# Altium project CIU.PrjPcb
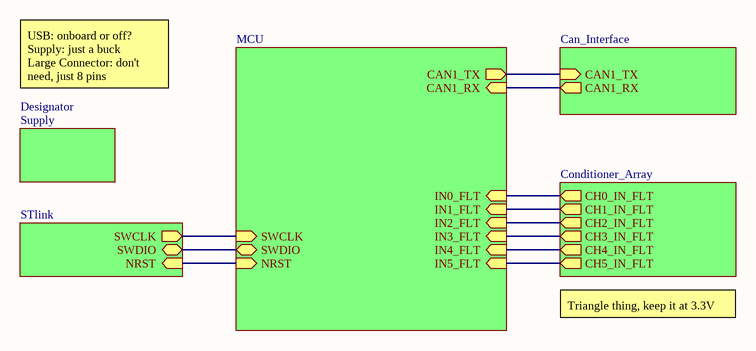
[diagram p0: Root.SchDoc]
8 sheets, 81 parts. Net scope: hierarchical (ports join the sheet entries above them; power ports are global).
Board files: OUR_CIU.PcbDoc, CIU.PcbDoc
Sheets:
  Root.SchDoc
    MCU = MCU.SchDoc
    Conditioner_Array = Conditioner_Array.SchDoc
      1 = Input_Conditioner.SchDoc
      2 = Input_Conditioner.SchDoc
      3 = Input_Conditioner.SchDoc
      4 = Input_Conditioner.SchDoc
      0 = Input_Conditioner.SchDoc
      5 = Input_Conditioner.SchDoc
      Designator = Connectors.SchDoc
      Designator = Connectors.SchDoc
      Designator = Connectors.SchDoc
      Designator = Connectors.SchDoc
      Designator = Connectors.SchDoc
      Designator = Connectors.SchDoc
    STlink = STlink.SchDoc
    Can_Interface = Can_Interface.SchDoc
    Designator = Supply.SchDoc

## Sheet Root.SchDoc
size A4; SheetNumber: 1; SheetTotal: 8

### Sub-sheets
Can_Interface = Can_Interface: CAN1_TX (in), CAN1_RX (out)
Conditioner_Array = Conditioner_Array: CH0_IN_FLT (out), CH1_IN_FLT (out), CH2_IN_FLT (out), CH3_IN_FLT (out), CH4_IN_FLT (out), CH5_IN_FLT (out)
Designator = Supply: no entries
MCU = MCU: IN1_FLT (in), IN2_FLT (in), IN3_FLT (in), IN4_FLT (in), IN5_FLT (in), IN0_FLT (in), SWCLK (in), SWDIO (bidir), CAN1_TX (out), CAN1_RX (in), NRST (in)
STlink = STlink: SWDIO (bidir), SWCLK (out), NRST (in)

### Nets
CAN1_RX: sheet MCU/CAN1_RX, sheet Can_Interface/CAN1_RX
CAN1_TX: sheet MCU/CAN1_TX, sheet Can_Interface/CAN1_TX
CH0_IN_FLT: sheet MCU/IN0_FLT, sheet Conditioner_Array/CH0_IN_FLT
CH1_IN_FLT: sheet MCU/IN1_FLT, sheet Conditioner_Array/CH1_IN_FLT
CH2_IN_FLT: sheet MCU/IN2_FLT, sheet Conditioner_Array/CH2_IN_FLT
CH3_IN_FLT: sheet MCU/IN3_FLT, sheet Conditioner_Array/CH3_IN_FLT
CH4_IN_FLT: sheet MCU/IN4_FLT, sheet Conditioner_Array/CH4_IN_FLT
CH5_IN_FLT: sheet MCU/IN5_FLT, sheet Conditioner_Array/CH5_IN_FLT
NRST: sheet MCU/NRST, sheet STlink/NRST
SWCLK: sheet MCU/SWCLK, sheet STlink/SWCLK
SWDIO: sheet MCU/SWDIO, sheet STlink/SWDIO

### Notes on the sheet
- USB: onboard or off?
  Supply: just a buck
  Large Connector: don't need, just 8 pins
- Triangle thing, keep it at 3.3V

## Sheet MCU.SchDoc
size A4; SheetNumber: 3; SheetTotal: 8
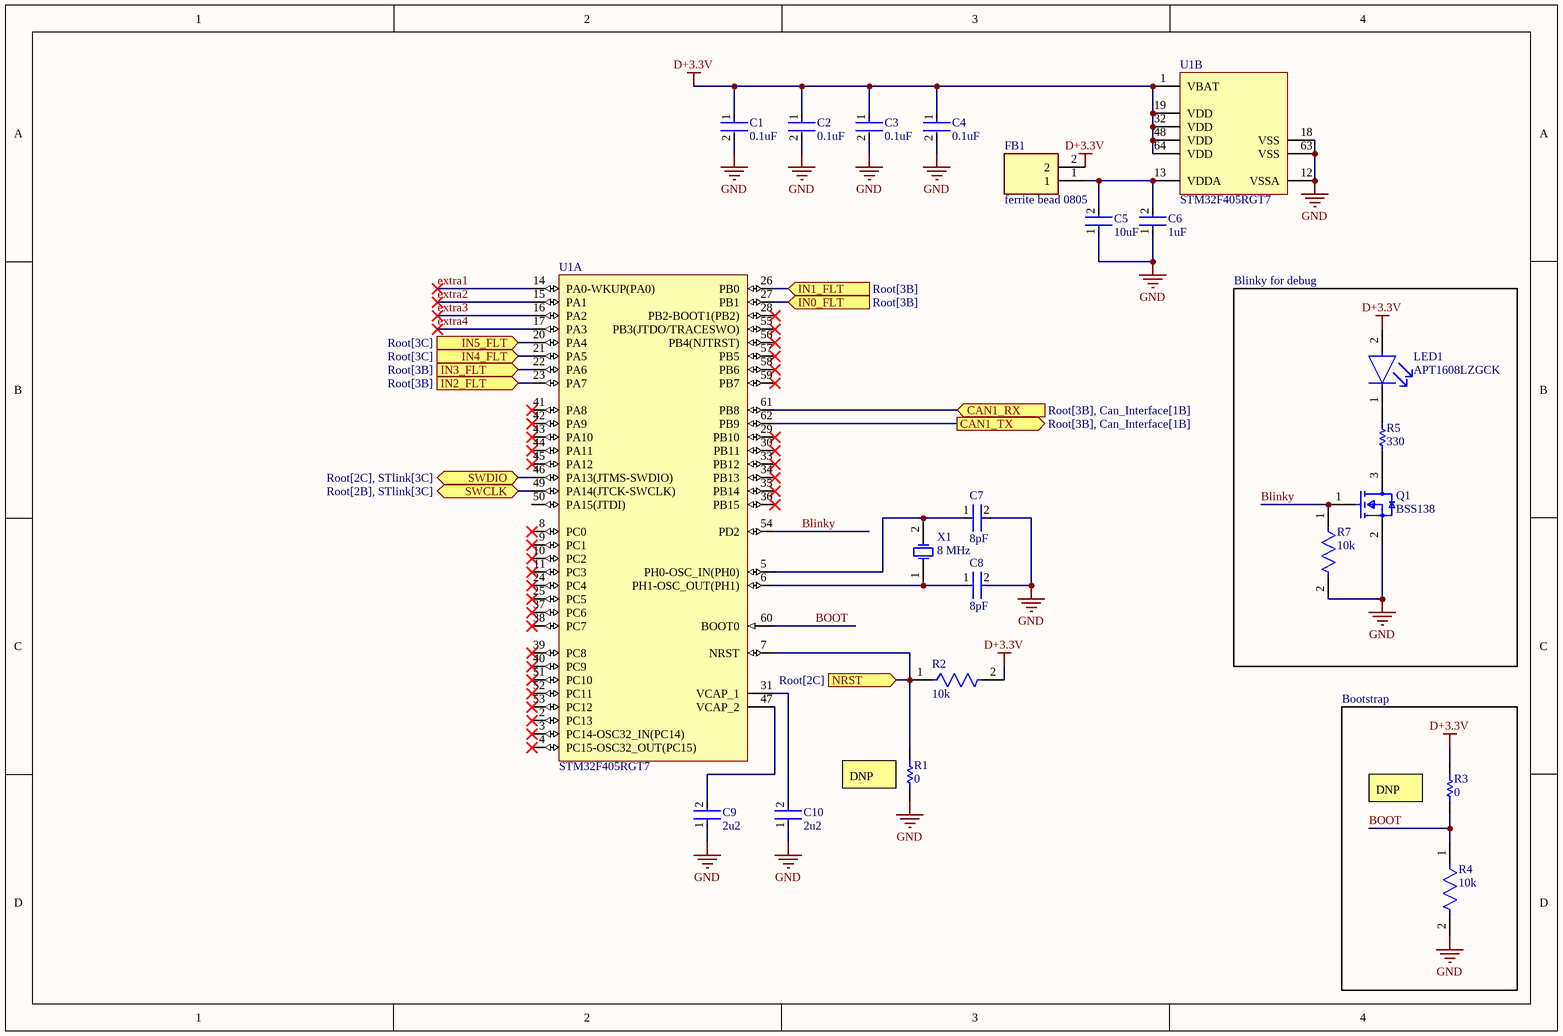
[diagram p1: MCU.SchDoc]

### Parts
C1  0.1uF  [FP-CC0603-DA-MFG]
C2  0.1uF  [FP-CC0603-DA-MFG]
C3  0.1uF  [FP-CC0603-DA-MFG]
C4  0.1uF  [FP-CC0603-DA-MFG]
C5  10uF  [FP-GRM21B-0_2-e0_2_0_7-IPC_C]
C6  1uF  [FP-CC0603-DA-MFG]
C7  8pF  [FP-C1608-080-0_1-IPC_C]
C8  8pF  [FP-C1608-080-0_1-IPC_C]
C9  2u2  [FP-CC0603-DA-MFG]
C10  2u2  [FP-CC0603-DA-MFG]
FB1  ferrite bead 0805  [FP-RC2012-IPC_A]
LED1  APT1608LZGCK  [FP-APT1608LZGCK-MFG]
Q1  BSS138  [FP-318-08-IPC_B]
R1  0  [RESC1608X55X25ML10T15]
R2  10k  [FP-RC0603-0_55-IPC_C]
R3  0  [RESC1608X55X25ML10T15]
R4  10k  [FP-RC0603-0_55-IPC_C]
R5  330  [RESC1608X55X25NL10T15]
R7  10k  [FP-RC0603-0_55-IPC_C]
U1  STM32F405RGT7  [STM-LQFP64_N]  (parts A,B of 2)
X1  8 MHz  [ABRA-ABM3-2_V]

### Blocks framed on the sheet
Blinky for debug: LED1 Q1 R5 R7
Bootstrap: R3 R4

### Ports
CAN1_RX (in, see Root[3B], Can_Interface[1B]), CAN1_TX (out, see Root[3B], Can_Interface[1B]), IN0_FLT (in, see Root[3B]), IN1_FLT (in, see Root[3B]), IN2_FLT (in, see Root[3B]), IN3_FLT (in, see Root[3B]), IN4_FLT (in, see Root[3C]), IN5_FLT (in, see Root[3C]), NRST (in, see Root[2C]), SWCLK (bidir, see Root[2B], STlink[3C]), SWDIO (bidir, see Root[2C], STlink[3C])

### Nets
D+3.3V: C1.1 C2.1 C3.1 C4.1 FB1.2 LED1.2(A) R2.2 R3.1 U1.1(VBAT) U1.19(VDD) U1.32(VDD) U1.48(VDD) U1.64(VDD)
GND: C1.2 C2.2 C3.2 C4.2 C5.1 C6.1 C7.2 C8.2 C9.1 C10.1 Q1.2(S) R1.1 R4.2 R7.2 U1.12(VSSA) U1.18(VSS) U1.63(VSS)
Blinky: Q1.1(G) R7.1 U1.54(PD2)
BOOT: R3.2 R4.1 U1.60(BOOT0)
CAN1_RX: U1.61(PB8) ; port CAN1_RX
CAN1_TX: U1.62(PB9) ; port CAN1_TX
CH0_IN_FLT: U1.27(PB1) ; port IN0_FLT
CH1_IN_FLT: U1.26(PB0) ; port IN1_FLT
CH2_IN_FLT: U1.23(PA7) ; port IN2_FLT
CH3_IN_FLT: U1.22(PA6) ; port IN3_FLT
CH4_IN_FLT: U1.21(PA5) ; port IN4_FLT
CH5_IN_FLT: U1.20(PA4) ; port IN5_FLT
extra1: U1.14(PA0-WKUP(PA0))
extra2: U1.15(PA1)
extra3: U1.16(PA2)
extra4: U1.17(PA3)
NRST: R1.2 R2.1 U1.7(NRST) ; port NRST
SWCLK: U1.49(PA14(JTCK-SWCLK)) ; port SWCLK
SWDIO: U1.46(PA13(JTMS-SWDIO)) ; port SWDIO
NetC5_2: C5.2 C6.2 FB1.1 U1.13(VDDA)
NetC7_1: C7.1 U1.5(PH0-OSC_IN(PH0)) X1.2(X2)
NetC8_1: C8.1 U1.6(PH1-OSC_OUT(PH1)) X1.1(X1)
NetC9_2: C9.2 U1.47(VCAP_2)
NetC10_2: C10.2 U1.31(VCAP_1)
NetLED1_1: LED1.1(C) R5.2
NetQ1_3: Q1.3(D) R5.1

Not connected (* = marked no-connect by the designer): U1 2(PC13)* 3(PC14-OSC32_IN(PC14))* 4(PC15-OSC32_OUT(PC15))* 8(PC0)* 9(PC1)* 10(PC2)* 11(PC3)* 24(PC4)* 25(PC5)* 28(PB2-BOOT1(PB2))* 29(PB10)* 30(PB11)* 33(PB12)* 34(PB13)* 35(PB14)* 36(PB15)* 37(PC6)* 38(PC7)* 39(PC8)* 40(PC9)* 41(PA8)* 42(PA9)* 43(PA10)* 44(PA11)* 45(PA12)* 50(PA15(JTDI)) 51(PC10)* 52(PC11)* 53(PC12)* 55(PB3(JTDO/TRACESWO))* 56(PB4(NJTRST))* 57(PB5)* 58(PB6)* 59(PB7)*

### Notes on the sheet
- (near R1) DNP
- (near R3) DNP

### Library data of the parts
C1-C4 = CMP-03422-000537-1: CAP CER 0.1UF 50V X7R 0603; Manufacturer: YAGEO; Manufacturer Part Number: CC0603MRX7R9BB104; Material: Ceramic; Capacitance: 100 nF; Temperature Coefficient: 15%; Tolerance: 0.2; Value: 100 nF; Temperature Range Low: -55°C; Height: 0.9mm; Temperature Range High: +125°C; Category: Cap; Package: CC0603-DA; Mouser Description: Cap Ceramic 50V 20% +Tol 20% -Tol X7R 15% TC 0.1uF SMD 0603; Temperature Characteristic: X7R; Footprint Url: http://www.yageo.com/exep/pages/download/literatures/UPY-C_GEN_24.pdf; Octopart: https://octopart.com/cc0603mrx7r9bb104-yageo-67308423; RoHS: TRUE; Voltage: 50 V; Lead Free: Yes; ComponentLink2URL: http://www.yageo.com/documents/recent/UPY-GPHC_X7R_6.3V-to-50V_18.pdf; ComponentLink2Description: Datasheet; Digikey Description: CAP CER 0.1UF 50V X7R 0603; Device Class L2: Capacitors; Automotive: No; Voltage Rating: 50 V; Temperature: -55°C to +125°C; Device Class L1: Passive Components; Device Class L3: Ceramic Capacitors
C5 = CMP-06035-007712-1: Chip Multilayer Ceramic Capacitors for General Purpose, 0805, 10uF, X7R, 15%, 10%, 16V
C6 = CMP-03422-001047-1: CC0603 1 uF X7R 10.00% 16 V; Manufacturer: YAGEO; Manufacturer Part Number: CC0603KPX7R7BB105; Temperature Coefficient: 15%; Tolerance: 0.1; Voltage Rating: 16 V; Material: Ceramic; Device Class L3: Ceramic Capacitors; Temperature Characteristic: X7R; Device Class L2: Capacitors; Temperature Range Low: -55°C; Footprint Url: http://www.yageo.com/exep/pages/download/literatures/UPY-C_GEN_24.pdf; Device Class L1: Passive Components; Temperature: -55°C to +125°C; RoHS: TRUE; ComponentLink2URL: http://www.yageo.com/documents/recent/UPY-GPHC_X7R_6.3V-to-50V_18.pdf; Mouser Description: Cap Ceramic 1uF 16V X7R 10% SMD 0603 125°C Paper T/R; Octopart: https://octopart.com/cc0603kpx7r7bb105-yageo-25629533; Automotive: No; Capacitance: 1 uF; Height: 0.9mm; Voltage: 16 V; Lead Free: Yes; Category: Cap; Package: CC0603-DA; Temperature Range High: +125°C; Value: 1 uF; ComponentLink2Description: Datasheet
C7 C8 = CMP-08246-003474-1: Multilayer Ceramic Capacitors 8pF ±0.5pF 50V NP0 SMD 0603; Dielectric: C0G; Series: C; Features: High Temperature; Case Code (Metric): 1608; Termination: SMD/SMT; Mount: Surface Mount; Package Quantity: 4000; Width: 0.031inch; Voltage Rating (DC): 50V; Height: 0.8mm; Case/Package: 0603; Lead Free: Lead Free; RoHS Compliant: Yes; Min Operating Temperature: -55°C; Capacitance: 8pF; Max Operating Temperature: 150°C; Weight: 7.1E-05oz; Thickness: 0.035inch; Packaging: Tape and Reel; Voltage Rating: 50V; Case Code (Imperial): 0603; Length: 0.063inch
C9 C10 = CMP-03422-001238-1: CAP CER 2.2UF 16V X7R 0603; Manufacturer: YAGEO; Manufacturer Part Number: CC0603KRX7R7BB225; Temperature Coefficient: 15%; Material: Ceramic; Tolerance: 0.1; Voltage: 16 V; Temperature Range High: +125°C; Digikey Description: CAP CER 2.2UF 16V X7R 0603; Temperature: -55°C to +125°C; Value: 2.2 uF; Lead Free: Yes; Capacitance: 2.2 uF; Package: CC0603-DA; ComponentLink2URL: http://www.yageo.com/documents/recent/UPY-GPHC_X7R_6.3V-to-50V_18.pdf; Device Class L1: Passive Components; Category: Cap; ComponentLink2Description: Datasheet; Mouser Description: Cap Ceramic 2.2uF 16V X7R 10% Pad SMD 0603 125C Automotive T/R; Device Class L2: Capacitors; RoHS: TRUE; Automotive: No; Voltage Rating: 16 V; Device Class L3: Ceramic Capacitors; Temperature Range Low: -55°C; Height: 0.9mm; Footprint Url: http://www.yageo.com/exep/pages/download/literatures/UPY-C_GEN_24.pdf; Temperature Characteristic: X7R; Octopart: https://octopart.com/cc0603krx7r7bb225-yageo-67146440
FB1 = FBMJ2125HS250NT: Manufacturer_Name: TAIYO YUDEN; Datasheet Link: https://mouser.componentsearchengine.com/Datasheets/1/FBMJ2125HS250NT.pdf; Height: 1.05mm; Manufacturer_Part_Number: FBMJ2125HS250NT; Mouser Part Number: 963-FBMJ2125HS250NT; Mouser Price/Stock: https://www.mouser.co.uk/ProductDetail/TAIYO-YUDEN/FBMJ2125HS250NT?qs=I6KAKw0tg2w%2F7qNkMvc%2FCQ%3D%3D; Arrow Part Number: FBMJ2125HS250NT; Arrow Price/Stock: null?region=nac
LED1 = CMP-44529-000040-1: LED GREEN CLEAR 2SMD; Dominant Wavelength: 525nm; Forward Voltage: 2.65V; Luminous Intensity: 50mcd; Test Current: 2mA; Viewing Angle: 120°; Lens Color: Colorless; Width: 0.8mm; Mount: Surface Mount; Lens Transparency: Clear; Length: 1.6mm; Packaging: Cut Tape; Case Code (Metric): 1608; Height: 0.75mm; Case/Package: 0603; Case Code (Imperial): 0603; Color: Green
Q1 = CMP-07173-000101-1: MOSFET N-CH 50V 220MA SOT-23; Turn-Off Delay Time: 20ns; Element Configuration: Single; Rds On Max: 3.5R; Gate to Source Voltage (Vgs): 20V; Threshold Voltage: 1.3V; Number of Elements: 1; Power Dissipation: 360mW; Rise Time: 9ns; Turn-On Delay Time: 2.5ns; Input Capacitance: 27pF; On-State Resistance: 6R; Lead Free: Lead Free; Length: 2.92mm; Width: 1.3mm; Drain to Source Breakdown Voltage: 50V; Min Operating Temperature: -55°C; REACH SVHC: No SVHC; Packaging: Tape and Reel; Radiation Hardening: No; Height: 0.93mm; Drain to Source Voltage (Vdss): 50V; Current Rating: 220mA; Voltage Rating (DC): 50V; Weight: 0.03g; Continuous Drain Current (ID): 220mA; Number of Pins: 3; Nominal Vgs: 1.3V; Max Power Dissipation: 360mW; Fall Time: 9ns; Drain to Source Resistance: 3.5R; Contact Plating: Tin; Case/Package: SOT-23; Package Quantity: 1; Dual Supply Voltage: 50V; Mount: Surface Mount; Termination: SMD/SMT; Max Operating Temperature: 150°C
R1 R3 = CMP-2100-03667-1: Chip Resistor, 0 Ohm, +/- 5%, 0.1 W, -55 to 155 degC, 0603 (1608 Metric), RoHS, Tape and Reel; Manufacturer: Yageo; Temperature Coefficient: 200ppm/degreesC; Voltage Rating: 50V; Power Rating: 100mW; Resistance: 0mOhm; Width: 0.8mm; Max Operating Temperature: 155degC; Tolerance: 5%; Package Reference: 0603; Height: 0.45mm; Depth: 0.8mm; Package Description: 2-Pin Surface Mount Device, Body 1.6 x 0.8 mm; Termination: SMD/SMT; Package Quantity: 5000; Case/Package: 0603; Case Code (Imperial): 0603; Radiation Hardening: No; Number of Pins: 2; Length: 1.6mm; Lead Free: LeadFree; Voltage Rating (DC): 50V; Military Standard: Not; Datasheet URL: http://www.yageo.com/NewPortal/yageodocoutput?fileName=/pdf/R-Chip/PYu-RC_Group_51_RoHS_L_5.pdf; Manufacturer URL: http://www.yageo.com/; Packaging: TapeandReel; Case Code (Metric): 1608; Min Operating Temperature: -55degC; Composition: ThickFilm; RoHSCompliant: true; Contact Plating: Tin; Datasheet Version: Rev. 5, 10/2016; REACH SVHC: NoSVHC
R2 R4 R7 = CMP-2100-03664-2: RES 10K OHM 1% 1/10W 0603; Voltage Rating: 75V; Voltage Rating (DC): 50V; Resistance: 10kR; Power Rating: 100mW; Temperature Coefficient: 100ppm/°C; Depth: 0.8mm; Termination: SMD/SMT; Resistor Type: Thick Film; Series: RC; Construction: Rectangular; Features: Moisture Resistant; Packaging: Tape and Reel; Min Operating Temperature: -55°C; Number of Terminations: 2; Lead Pitch: 0.3mm; RoHS Compliant: Yes; Case/Package: 0603; Resistance Tolerance: 1%; Military Standard: Not; Weight: 7.1E-05oz; Number of Pins: 2; Tolerance: 1%; Length: 1.6mm; Case Code (Imperial): 0603; Lead Free: Lead Free; Width: 0.8mm; Max Power Dissipation: 100mW; Height: 0.45mm; Max Operating Temperature: 155°C; Case Code (Metric): 1608; Size Code: 0603
R5 = CMP-1659-00020-2: Chip Resistor, 330 Ohm, +/- 1%, 0.1 W, -55 to 155 degC, 0603 (1608 Metric), RoHS, Tape and Reel; Tolerance: 10%; ESR: 800 mohm; Voltage Rating (DC): 16 V; Capacitance: 47 uF; Length: 7.3 mm; ComponentLink1URL: http://www.yageo.com/; Packaging: Tape and Reel; Pins: 2; ComponentLink1Description: Manufacturer URL; Case Code (Imperial): 2917; REACH SVHC: No SVHC; Width: 4.3 mm; ComponentLink2Description: Datasheet; Voltage Rating: 16 V; RoHSCompliant: True; Max Operating Temperature: 125degC; ComponentLink2URL: http://www.yageo.com/documents/recent/PYu-RC_Group_51_RoHS_L_04.pdf; Min Operating Temperature: -55degC; Case/Package: 2917; Radiation Hardening: No; DatasheetVersion: Rev. 4, 02/2016; Mount: Surface Mount; PackageReference: 0603; Package Quantity: 500; Case Code (Metric): 7343; PackageDescription: 2-Pin Surface Mount Device, Body 1.6 x 0.8 mm; Height: 3.1 mm
U1 = CMP-0243-00093-2: ARM Cortex-M4 32-bit MCU+FPU, 210 DMIPS, 1024 kB Flash, 192 kB Internal RAM, 51 I/Os, 64-pin LQFP, -40 to 105 degC, Tray; Manufacturer: STMicroelectronics; D/A Converter: 2x12-bit; Internal RAM Size (kB): 192; Supply Voltage(Vcc) min (V): 1.8; Supply Voltage(Vcc) max (V): 3.6; FLASH Size (Prog) (kB): 1024; I/Os (High Current): 51; Operating Frequency(F) (Processor speed) (MHz): 168; PackageVersion: Rev. 4, 06/2013; PackageDescription: 64-Pin Low Profile Quad Flat Package, 10 x 10 mm Body, 0.5 mm Pitch; Packing: Tray; ComponentLink2Description: Datasheet; PackageReference: LQFP64; ComponentLink1URL: http://www.st.com/web/en/home.html; ComponentLink2URL: http://www.st.com/st-web-ui/static/active/en/resource/technical/document/datasheet/DM00037051.pdf; ComponentLink1Description: Manufacturer URL; Core: ARM Cortex-M4; PartNumber: STM32F405RGT7; Mounting Technology: Surface Mount; DatasheetVersion: Rev. 4; ComponentLink3URL: http://www.st.com/st-web-ui/static/active/en/resource/technical/document/datasheet/DM00037051.pdf; ComponentLink3Description: Package Specification
X1 = CMP-2000-05033-1: AA-8.000MALV-T; Manufacturer: ABRACON; Case Length: 5mm; Case Width: 3.2mm; Case Height: 1.3mm; Load Capacitance: 18pF; Frequency: 8MHz; Frequency Stability: 30PPM; ESR: 140Ohms; Tolerance: 20PPM; Type: MiniatureCeramicCrystal; Factory Pack Quantity: 1000; Package / Case: 5mmx3.2mm; Mounting Style: SMD/SMT; Manufacturer URL: http://www.abracon.com/; RoHS: Details; Dimensions: 3.2mmWx5mmLx1.3mmH; Datasheet URL: http://www.farnell.com/datasheets/1754353.pdf; Brand: ABRACON; Packaging: Reel; Product Category: Crystals; Package Description: 2-Pin Surface Mount Device, Body 5 x 3.2 mm; Package URL: http://www.abracon.com/Support/PackageDrawing/Resonators/ABM3.PDF; Operating Temperature Range: -40Cto+85C; Termination Style: SMD/SMT; Datasheet Version: Sep-13; Series: ABM3; Package Reference: ABM3-2

## Sheet Conditioner_Array.SchDoc
size A4; SheetNumber: 3; SheetTotal: 8
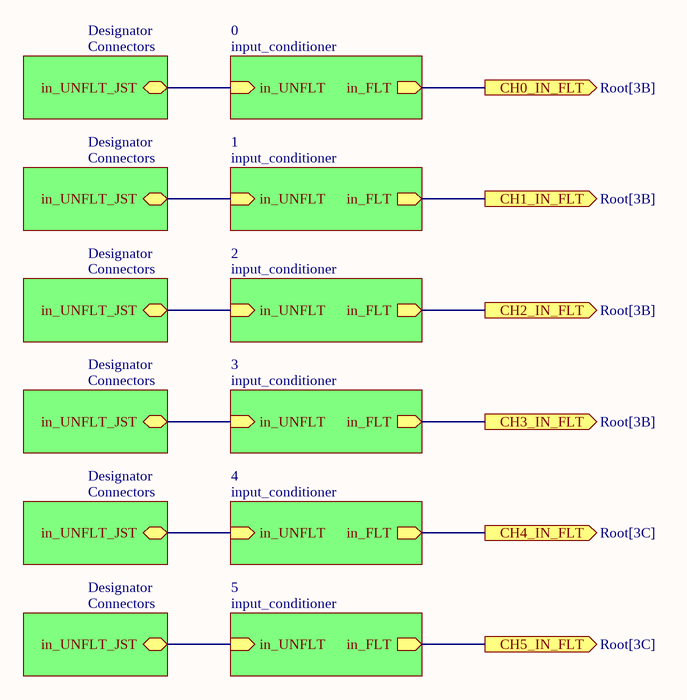
[diagram p2: Conditioner_Array.SchDoc]

### Sub-sheets
0 = input_conditioner: in_UNFLT (in), in_FLT (out)
1 = input_conditioner: in_UNFLT (in), in_FLT (out)
2 = input_conditioner: in_UNFLT (in), in_FLT (out)
3 = input_conditioner: in_UNFLT (in), in_FLT (out)
4 = input_conditioner: in_UNFLT (in), in_FLT (out)
5 = input_conditioner: in_UNFLT (in), in_FLT (out)
Designator = Connectors: in_UNFLT_JST (bidir)
Designator = Connectors: in_UNFLT_JST (bidir)
Designator = Connectors: in_UNFLT_JST (bidir)
Designator = Connectors: in_UNFLT_JST (bidir)
Designator = Connectors: in_UNFLT_JST (bidir)
Designator = Connectors: in_UNFLT_JST (bidir)

### Ports
CH0_IN_FLT (out, see Root[3B]), CH1_IN_FLT (out, see Root[3B]), CH2_IN_FLT (out, see Root[3B]), CH3_IN_FLT (out, see Root[3B]), CH4_IN_FLT (out, see Root[3C]), CH5_IN_FLT (out, see Root[3C])

### Nets
CH0_IN_FLT: port CH0_IN_FLT, sheet 0/in_FLT
CH1_IN_FLT: port CH1_IN_FLT, sheet 1/in_FLT
CH2_IN_FLT: port CH2_IN_FLT, sheet 2/in_FLT
CH3_IN_FLT: port CH3_IN_FLT, sheet 3/in_FLT
CH4_IN_FLT: port CH4_IN_FLT, sheet 4/in_FLT
CH5_IN_FLT: port CH5_IN_FLT, sheet 5/in_FLT
in_UNFLT: sheet 1/in_UNFLT, sheet Designator/in_UNFLT_JST
in_UNFLT: sheet 2/in_UNFLT, sheet Designator/in_UNFLT_JST  [a separate net that carries the same name]
in_UNFLT: sheet 3/in_UNFLT, sheet Designator/in_UNFLT_JST  [a separate net that carries the same name]
in_UNFLT: sheet 4/in_UNFLT, sheet Designator/in_UNFLT_JST  [a separate net that carries the same name]
in_UNFLT: sheet 0/in_UNFLT, sheet Designator/in_UNFLT_JST  [a separate net that carries the same name]
in_UNFLT: sheet 5/in_UNFLT, sheet Designator/in_UNFLT_JST  [a separate net that carries the same name]

## Sheet Input_Conditioner.SchDoc
size A4; SheetNumber: 5; SheetTotal: 8
Used 6 times, as channels Conditioner_Array/1, Conditioner_Array/2, Conditioner_Array/3, Conditioner_Array/4, Conditioner_Array/0, Conditioner_Array/5. Parts and nets are listed once, with the designators drawn on the sheet.
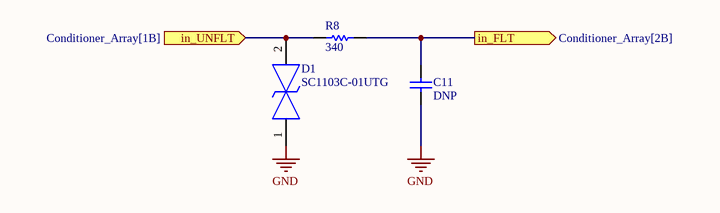
[diagram p3: Input_Conditioner.SchDoc]

### Parts
C11  value DNP  [FP-RC1608-IPC_A]  (hidden comment: Capacitor)
D1  SC1103C-01UTG  [SC1103C01UTG]
R8  340  [RESC1608X55X25LL10T15]

### Ports
in_FLT (out, see Conditioner_Array[2B]), in_UNFLT (in, see Conditioner_Array[1B])

### Nets
GND: C11.2 D1.1
in_FLT: C11.1 R8.2 ; port in_FLT
in_UNFLT: D1.2 R8.1 ; port in_UNFLT

### Channels
Conditioner_Array/1: designators end in _1; ports in_FLT=CH1_IN_FLT in_UNFLT=in_UNFLT
Conditioner_Array/2: designators end in _2; ports in_FLT=CH2_IN_FLT in_UNFLT=in_UNFLT
Conditioner_Array/3: designators end in _3; ports in_FLT=CH3_IN_FLT in_UNFLT=in_UNFLT
Conditioner_Array/4: designators end in _4; ports in_FLT=CH4_IN_FLT in_UNFLT=in_UNFLT
Conditioner_Array/0: designators end in _0; ports in_FLT=CH0_IN_FLT in_UNFLT=in_UNFLT
Conditioner_Array/5: designators end in _5; ports in_FLT=CH5_IN_FLT in_UNFLT=in_UNFLT

### Library data of the parts
C11 = Capacitor: SimulationGenericComponent: True
D1 = SC1103C-01UTG: TVS Diode (Bi-directional); Manufacturer_Name: LITTELFUSE; Datasheet Link: https://www.littelfuse.com/media?resourcetype=datasheets&itemid=00ca821d-8080-42f3-aae6-7cab4684d809&filename=littelfuse-tvs-diode-array-sc1103c-01utg-datasheet-1; Height: 0.55mm; Manufacturer_Part_Number: SC1103C-01UTG; Mouser Part Number: 576-SC1103C-01UTG; Mouser Price/Stock: https://www.mouser.co.uk/ProductDetail/Littelfuse/SC1103C-01UTG?qs=Rp5uXu7WBW8S8u%2FopEdSug%3D%3D; Arrow Part Number: SC1103C-01UTG; Arrow Price/Stock: null?region=nac
R8 = CMP-2000-04016-1: Part Number: RC0603FR-07340RL; Manufacturer: Yageo

## Sheet Connectors.SchDoc
size OrCAD A; SheetNumber: 6; SheetTotal: 8
Used 6 times, as channels Conditioner_Array/Designator, Conditioner_Array/Designator, Conditioner_Array/Designator, Conditioner_Array/Designator, Conditioner_Array/Designator, Conditioner_Array/Designator. Parts and nets are listed once, with the designators drawn on the sheet.
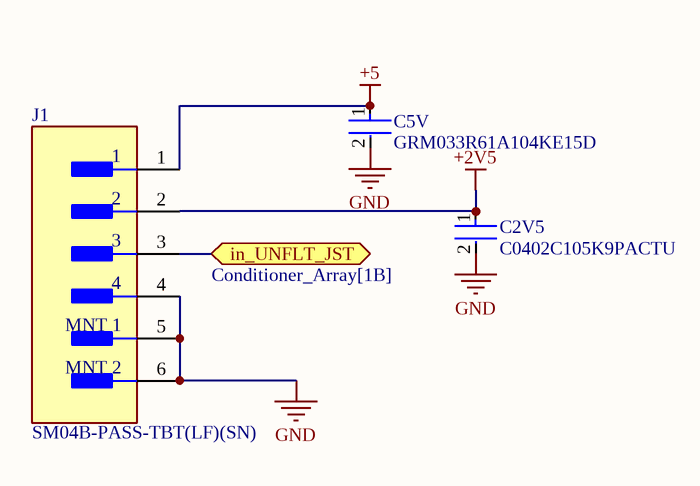
[diagram p4: Connectors.SchDoc]

### Parts
C2V5  C0402C105K9PACTU  [FP-C0402C105K9PACTU-MFG]
C5V  GRM033R61A104KE15D  [FP-GRM033-0_03-IPC_C]
J1  SM04B-PASS-TBT(LF)(SN)  [FP-SM04B-PASS-TBT_LF_SN-MFG]

### Ports
in_UNFLT_JST (bidir, see Conditioner_Array[1B])

### Nets
+2V5: C2V5.1 J1.2
+5: C5V.1 J1.1
GND: C2V5.2 C5V.2 J1.4 J1.5(MNT_1) J1.6(MNT_2)
in_UNFLT_JST: J1.3 ; port in_UNFLT_JST

### Channels
Conditioner_Array/Designator: designators end in _Designator6; ports in_UNFLT_JST=in_UNFLT
Conditioner_Array/Designator: designators end in _Designator5; ports in_UNFLT_JST=in_UNFLT
Conditioner_Array/Designator: designators end in _Designator4; ports in_UNFLT_JST=in_UNFLT
Conditioner_Array/Designator: designators end in _Designator3; ports in_UNFLT_JST=in_UNFLT
Conditioner_Array/Designator: designators end in _Designator2; ports in_UNFLT_JST=in_UNFLT
Conditioner_Array/Designator: designators end in _Designator1; ports in_UNFLT_JST=in_UNFLT

### Library data of the parts
C2V5 = CMP-2008-02075-2: CAP CER 1UF 6.3V X5R 0402; Tolerance: 10%; Dielectric Material: Ceramic; Series: C; Lead Free: Lead Free; Min Operating Temperature: -55°C; Capacitance: 1uF; Voltage Rating (DC): 6.3V; Number of Pins: 2; REACH SVHC: No SVHC; Mount: Surface Mount; Lead Pitch: 0.3mm; Case Code (Imperial): 0402; RoHS Compliant: Yes; Radiation Hardening: No; Construction: Flat; Depth: 0.5mm; Case/Package: 0402; Termination: SMD/SMT; Height: 0.5mm; Thickness: 0.022inch; Voltage: 6.3V; Dielectric: X5R; Width: 0.02inch; Voltage Rating: 6.3V; Max Operating Temperature: 85°C; Packaging: Tape and Reel; Package Quantity: 1; Length: 1mm
C5V = CMP-2010-01264-2: Chip Multilayer Ceramic Capacitors for General Purpose, 0201, 0.10uF, X5R, 15%, 10%, 10V; Capacitance: 100nF; Mount: Surface Mount; Dielectric: X5R; Width: 0.012inch; Tolerance: 10%; Radiation Hardening: No; Voltage Rating: 10V; REACH SVHC: No SVHC; Height: 0.3mm; Max Operating Temperature: 85°C; Voltage Rating (DC): 10V; Thickness: 0.013inch; Termination: SMD/SMT; Lead Free: Lead Free; Package Quantity: 1; Case/Package: 0201; Min Operating Temperature: -55°C; Weight: 6E-06oz; Length: 0.6mm; Case Code (Imperial): 0201; Depth: 0.3mm; Voltage: 10V; Packaging: Tape and Reel; Case Code (Metric): 0603
J1 = CMP-2000-07078-2: CONN HEADER SMD R/A 4POS 2MM; Manufacturer: JST; Voltage Rating: 250V; Current Rating: 3A; Conn Gender: Male; Conn Orientation: Right Angle; Number Of Contacts: 4; Height: 5.7mm; Contact Material: Tin; Device Class L2: Headers and Wire Housings; Number Of Rows: 1; Device Class L1: Connectors; RoHS: TRUE; Lead Free: Yes; Automotive: No; Digikey Description: CONN HEADER SMD R/A 4POS 2MM; Manufacturer Part Number: SM04B-PASS-TBT(LF)(SN); Temperature: -25°C to +85°C; Package: SM04B-PASS-TBT(LF)(SN); Temperature Range Low: -25°C; ComponentLink2Description: Datasheet; Temperature Range High: +85°C; Pitch: 2mm; ComponentLink2URL: http://www.jst-mfg.com/product/pdf/eng/ePA-F.pdf; Octopart: https://octopart.com/sm04b-pass-tbt%28lf%29%28sn%29-jst-3990422; Category: Conn; Device Class L3: unset

## Sheet STlink.SchDoc
size A4; SheetNumber: 8; SheetTotal: 8
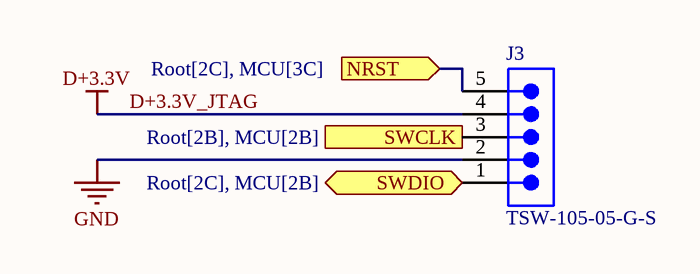
[diagram p5: STlink.SchDoc]

### Parts
J3  TSW-105-05-G-S  [SMTC-TSW-105-05-X-S]

### Ports
NRST (in, see Root[2C], MCU[3C]), SWCLK (out, see Root[2B], MCU[2B]), SWDIO (bidir, see Root[2C], MCU[2B])

### Nets
D+3.3V: J3.4  [also labelled D+3.3V_JTAG]
GND: J3.2
NRST: J3.5 ; port NRST
SWCLK: J3.3 ; port SWCLK
SWDIO: J3.1 ; port SWDIO

### Library data of the parts
J3 = CMP-1024-00363-1: 0.025" SQ Post Header, Through-hole, Vertical, -55 to 125 degC, 2.54 mm Pitch, 5-Pin, Male, RoHS; Manufacturer: Samtec; Pitch: 2.54 mm; ComponentLink3URL: http://www.samtec.com/documents/webfiles/cpdf/TSW-XXX-XX-XXX-X-XX-XXX-MKT.pdf; RoHS: True; PackageReference: TSW-105-05-X-S; Orientation: Vertical; ComponentLink2Description: Datasheet; Mounting Technology: Through-hole; PackageVersion: DM, 8/1988; PartNumber: TSW-105-05-G-S; ComponentLink1Description: Manufacturer URL; PackageDescription: .025[0.64] SQ. Post Terminal Strip Assembly; ComponentLink1URL: http://www.samtec.com; DatasheetVersion: F-214; Temperature Range: -55 to 125 degC; ComponentLink3Description: Package Specification; ComponentLink2URL: http://www.samtec.com/documents/webfiles/pdf/TSW_TH.PDF

## Sheet Can_Interface.SchDoc
size A4; SheetNumber: 7; SheetTotal: 8
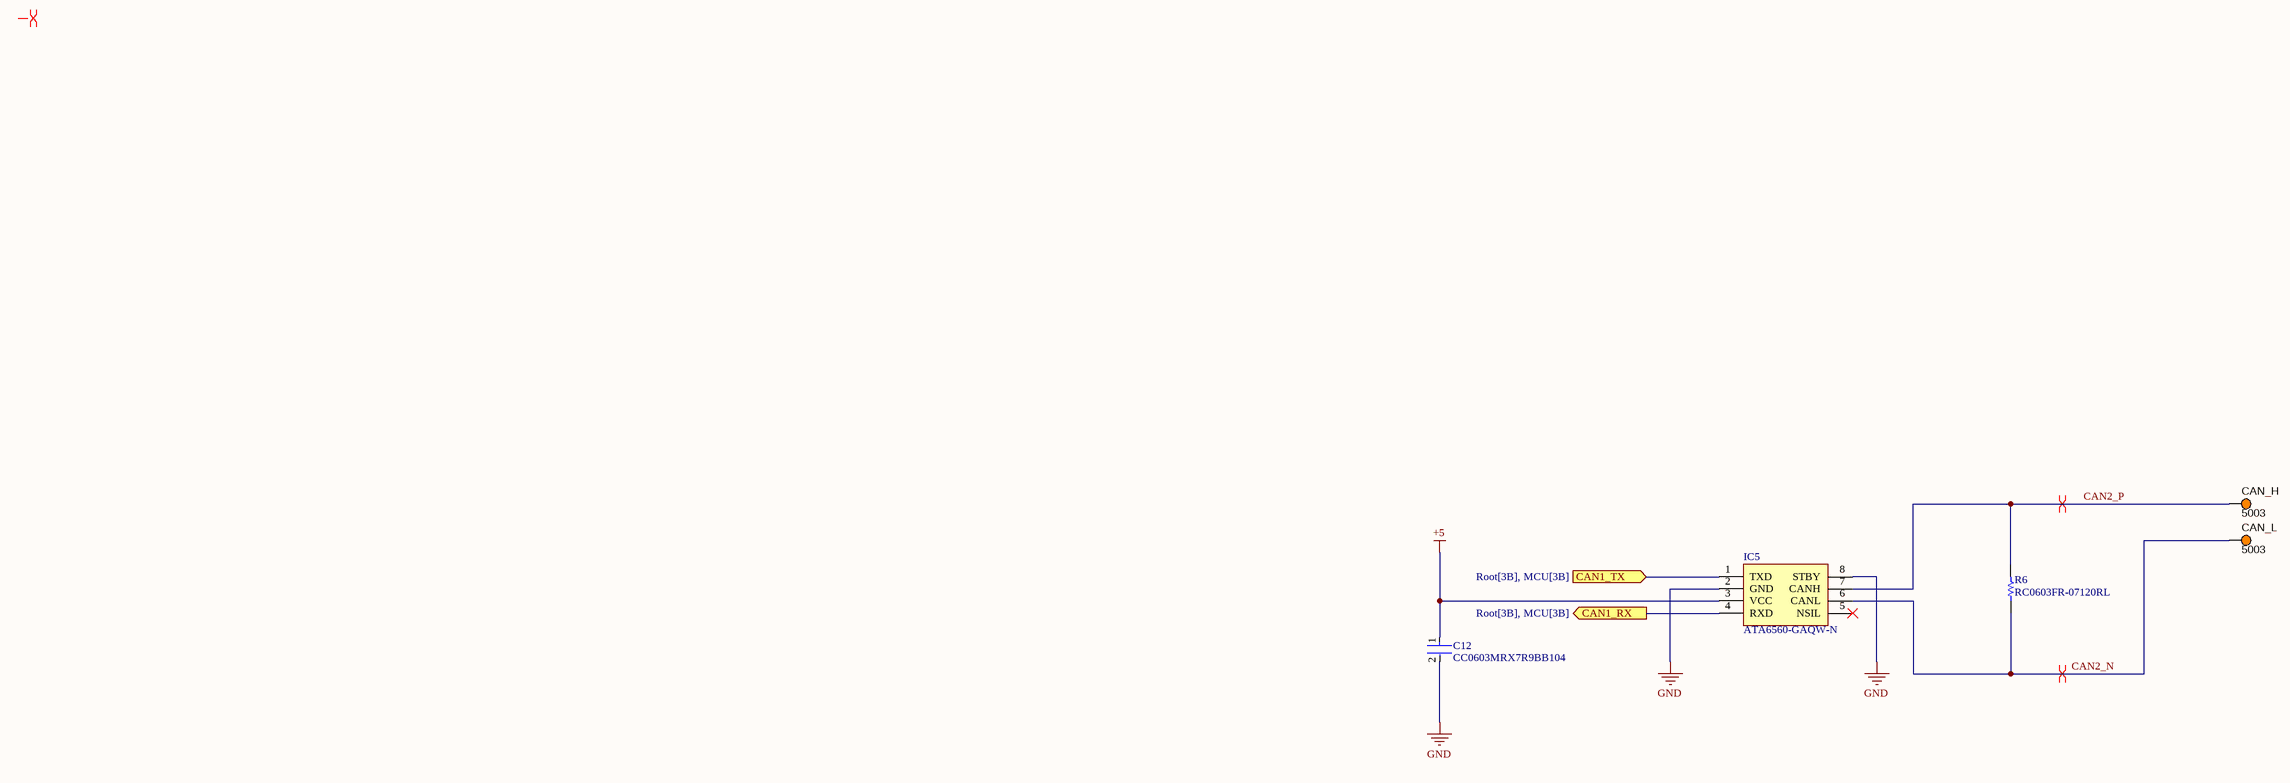
[diagram p6: Can_Interface.SchDoc]

### Parts
C12  CC0603MRX7R9BB104  [FP-CC0603-DA-MFG]
CAN_H  5003  [KSTN-5003]
CAN_L  5003  [KSTN-5003]
IC5  ATA6560-GAQW-N  [SOIC8_4P9X3P9MC_MCH]
R6  RC0603FR-07120RL  [RESC1608X55X25NL10T15]

### Ports
CAN1_RX (out, see Root[3B], MCU[3B]), CAN1_TX (in, see Root[3B], MCU[3B])

### Nets
+5: C12.1 IC5.3(VCC)
GND: C12.2 IC5.2(GND) IC5.8(STBY)
CAN1_RX: IC5.4(RXD) ; port CAN1_RX
CAN1_TX: IC5.1(TXD) ; port CAN1_TX
CAN2_N: CAN_L.1 IC5.6(CANL) R6.1
CAN2_P: CAN_H.1 IC5.7(CANH) R6.2

Not connected (* = marked no-connect by the designer): IC5 5(NSIL)*

### Layout directives
differential pair: (no net found under the mark), CAN2_N, CAN2_P

### Library data of the parts
C12 = CMP-03422-000537-1: CAP CER 0.1UF 50V X7R 0603; Manufacturer: YAGEO; Material: Ceramic; Capacitance: 100 nF; Temperature Coefficient: 15%; Tolerance: 0.2; Value: 100 nF; Temperature Range Low: -55°C; Height: 0.9mm; Temperature Range High: +125°C; Category: Cap; Package: CC0603-DA; Mouser Description: Cap Ceramic 50V 20% +Tol 20% -Tol X7R 15% TC 0.1uF SMD 0603; Temperature Characteristic: X7R; Footprint Url: http://www.yageo.com/exep/pages/download/literatures/UPY-C_GEN_24.pdf; Octopart: https://octopart.com/cc0603mrx7r9bb104-yageo-67308423; RoHS: TRUE; Voltage: 50 V; Manufacturer Part Number: CC0603MRX7R9BB104; Lead Free: Yes; ComponentLink2URL: http://www.yageo.com/documents/recent/UPY-GPHC_X7R_6.3V-to-50V_18.pdf; ComponentLink2Description: Datasheet; Digikey Description: CAP CER 0.1UF 50V X7R 0603; Device Class L2: Capacitors; Automotive: No; Voltage Rating: 50 V; Temperature: -55°C to +125°C; Device Class L1: Passive Components; Device Class L3: Ceramic Capacitors
CAN_H CAN_L = CMP-002-00037-2: Test Point, Orange, Height 4.6 mm, Tail Length 3 mm, 1-Pin THD, RoHS; Manufacturer: Keystone; Colour: Orange; Packaging: Bulk; Package Description: 1-Pin Through Hole Device, Dia 2.54 mm; Pins: 1; Package Reference: 5003; Datasheet Version: Jun-15; Case/Package: 5003; Mounting Technology: TH; Connector Type: TestPoint; Diameter: 2.54mm; Contact Material: Bronze; Datasheet URL: http://keyelco.com/userAssets/file/M65p56.pdf; Manufacturer URL: http://www.keyelco.com/; Package Quantity: 10; Contact Plating: Tin; RoHS Compliant: True
IC5 = ATA6560-GAQW-N: Integrated Circuit; Manufacturer_Name: Microchip; Datasheet Link: https://mouser.componentsearchengine.com/Datasheets/1/ATA6560-GAQW-N.pdf; Height: 1.75mm; Manufacturer_Part_Number: ATA6560-GAQW-N; Mouser Part Number: 579-ATA6560-GAQW-N; Mouser Price/Stock: https://www.mouser.co.uk/ProductDetail/Microchip-Technology-Atmel/ATA6560-GAQW-N?qs=y6ZabgHbY%252By0WOzqKXUktg%3D%3D; Arrow Part Number: ATA6560-GAQW-N; Arrow Price/Stock: https://www.arrow.com/en/products/ata6560-gaqw-n/microchip-technology?region=nac
R6 = CMP-1659-00034-1: Chip Resistor, 120 Ohm, +/- 1%, 100 mW, -55 to 155 degC, 0603 (1608 Metric), RoHS, Tape and Reel; Nominal Vf: 2.1 V; Power Rating: 90 mW; Case\Package: 0603; Lens Style: Diffused; Viewing Angle: 160 degrees; Forward Current: 20 mA; Luminous Intensity: 80 mcd; Illumination Colour: Orange; Nominal Wavelength: 606 nm; Package Quantity: 3000; Radiation Hardening: No; ComponentLink2URL: http://www.yageo.com/documents/recent/PYu-RC_Group_51_RoHS_L_04.pdf; Mount: Surface Mount; ComponentLink1URL: http://www.yageo.com/; PackageReference: 0603; PackageDescription: 2-Pin Surface Mount Device, Body 1.6 x 0.8 mm; Min Operating Temperature: -40 degC; Colour: Orange; Case Code (Metric): 1608; Length: 1.6 mm; Width: 0.8 mm; Packaging: Tape and Reel; Case Code (Imperial): 0603; RoHSCompliant: true; Height: 0.6 mm; DatasheetVersion: Rev. 4, 02/2016; Pins: 2; ComponentLink1Description: Manufacturer URL; Forward Voltage: 2.1 V; Max Operating Temperature: 100 degC; REACH SVHC: Unknown; ComponentLink2Description: Datasheet

## Sheet Supply.SchDoc
size A4; SheetNumber: 2; SheetTotal: 8
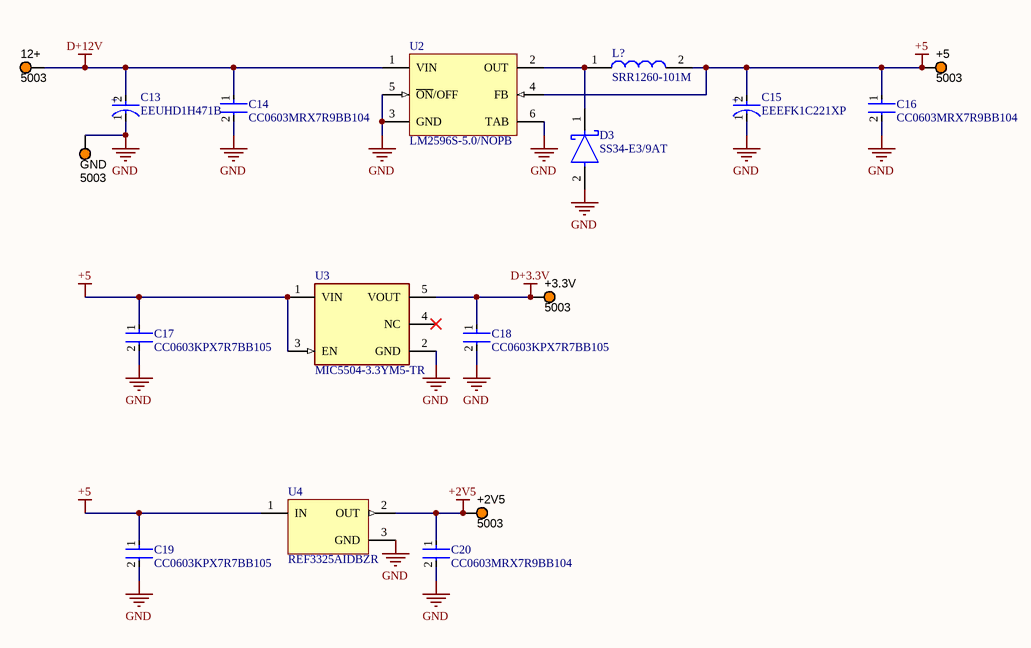
[diagram p7: Supply.SchDoc]

### Parts
12+  5003  [KSTN-5003]
+2V5  5003  [KSTN-5003]
+3.3V  5003  [KSTN-5003]
+5  5003  [KSTN-5003]
C13  EEUHD1H471B  [FP-RAD-TH-D_10_0_5-L_20_2-MFG]
C14  CC0603MRX7R9BB104  [FP-CC0603-DA-MFG]
C15  EEEFK1C221XP  [FP-FKD8-MFG]
C16  CC0603MRX7R9BB104  [FP-CC0603-DA-MFG]
C17  CC0603KPX7R7BB105  [FP-CC0603-DA-MFG]
C18  CC0603KPX7R7BB105  [FP-CC0603-DA-MFG]
C19  CC0603KPX7R7BB105  [FP-CC0603-DA-MFG]
C20  CC0603MRX7R9BB104  [FP-CC0603-DA-MFG]
D3  SS34-E3/9AT  [FP-SMC-MFG]
GND  5003  [KSTN-5003]
L?  SRR1260-101M  [SRR1260101M]
U2  LM2596S-5.0/NOPB  [KTT0005B_M]
U3  MIC5504-3.3YM5-TR  [FP-SOT23-5LD-PL-1-MFG]
U4  REF3325AIDBZR  [DBZ0003A_N]

### Nets
+2V5: +2V5.1 C20.1 U4.2(OUT)
+5: +5.1 C15.2(A) C16.1 C17.1 C19.1 L?.2 U2.4(FB) U3.1(VIN) U3.3(EN) U4.1(IN)
D+3.3V: +3.3V.1 C18.1 U3.5(VOUT)
D+12V: 12+.1 C13.2(A) C14.1 U2.1(VIN)
GND: C13.1(C) C14.2 C15.1(C) C16.2 C17.2 C18.2 C19.2 C20.2 D3.2(A) GND.1 U2.3(GND) U2.5(~{ON}/OFF) U2.6(TAB) U3.2(GND) U4.3(GND)
NetD3_1: D3.1(C) L?.1 U2.2(OUT)

Not connected (* = marked no-connect by the designer): U3 4(NC)*

### Notes on the sheet
- (in symbol CMP-05427-000071-1) +
- (in symbol CMP-05427-002121-1) +

### Library data of the parts
12+ +2V5 +3.3V +5 GND = CMP-002-00037-2: as CAN_H on sheet Can_Interface; Colour: Orange; Packaging: Bulk; Package Description: 1-Pin Through Hole Device, Dia 2.54 mm; Pins: 1; Package Reference: 5003; Datasheet Version: Jun-15; Case/Package: 5003; Mounting Technology: TH; Connector Type: TestPoint; Diameter: 2.54mm; Contact Material: Bronze; Datasheet URL: http://keyelco.com/userAssets/file/M65p56.pdf; Manufacturer URL: http://www.keyelco.com/; Package Quantity: 10; Contact Plating: Tin; RoHS Compliant: True
C13 = CMP-05427-002121-1: Aluminum Electrolytic Capacitors (Radial Lead Type) AEC-Q200 Qualified 470uF ±20% 50V
C14 C16 C20 = CMP-03422-000537-1: as C12 on sheet Can_Interface; Temperature Range Low: -55°C; Height: 0.9mm; Temperature Range High: +125°C; Category: Cap; Package: CC0603-DA; Mouser Description: Cap Ceramic 50V 20% +Tol 20% -Tol X7R 15% TC 0.1uF SMD 0603; Temperature Characteristic: X7R; Footprint Url: http://www.yageo.com/exep/pages/download/literatures/UPY-C_GEN_24.pdf; Octopart: https://octopart.com/cc0603mrx7r9bb104-yageo-67308423; RoHS: TRUE; Voltage: 50 V; Manufacturer Part Number: CC0603MRX7R9BB104; Lead Free: Yes; ComponentLink2URL: http://www.yageo.com/documents/recent/UPY-GPHC_X7R_6.3V-to-50V_18.pdf; ComponentLink2Description: Datasheet; Digikey Description: CAP CER 0.1UF 50V X7R 0603; Device Class L2: Capacitors; Automotive: No; Voltage Rating: 50 V; Temperature: -55°C to +125°C; Device Class L1: Passive Components; Device Class L3: Ceramic Capacitors
C15 = CMP-05427-000071-1: CAP ALUM 220UF 20% 16V SMD; Life (Hours): 2000Hour; Ripple Current (AC): 280mA; Leakage Current: 3uA; Polarity: Polar; Material: Aluminium; Impedance: 340mR; Voltage Rating: 16V; Length: 7.7mm; Voltage: 16V; Termination: SMD/SMT; Voltage Rating (DC): 16V; Radiation Hardening: No; Number of Pins: 8; Construction: Cylindrical; Min Operating Temperature: -55°C; Mount: Surface Mount; Series: FK; Height: 7.7mm; REACH SVHC: No SVHC; Tolerance: 20%; Ripple Current: 280mA; Diameter: 6.3mm; RoHS Compliant: Yes; Case/Package: Radial; Height - Seated (Max): 0.315inch; Package Quantity: 900; Packaging: Tape and Reel; Max Operating Temperature: 105°C; Lead Free: Lead Free; Contact Plating: Tin; Width: 8.3mm; Capacitance: 220uF; ESR (Equivalent Series Resistance): 340mR
C17-C19 = CMP-03422-001047-1: CC0603 1 uF X7R 10.00% 16 V; Manufacturer: YAGEO; Temperature Coefficient: 15%; Tolerance: 0.1; Voltage Rating: 16 V; Capacitance: 1 uF; Material: Ceramic; Value: 1 uF; Device Class L3: Ceramic Capacitors; Temperature Characteristic: X7R; Device Class L2: Capacitors; Temperature Range Low: -55°C; Footprint Url: http://www.yageo.com/exep/pages/download/literatures/UPY-C_GEN_24.pdf; Device Class L1: Passive Components; Temperature: -55°C to +125°C; RoHS: TRUE; ComponentLink2URL: http://www.yageo.com/documents/recent/UPY-GPHC_X7R_6.3V-to-50V_18.pdf; Mouser Description: Cap Ceramic 1uF 16V X7R 10% SMD 0603 125°C Paper T/R; Octopart: https://octopart.com/cc0603kpx7r7bb105-yageo-25629533; Automotive: No; Height: 0.9mm; Voltage: 16 V; Lead Free: Yes; Category: Cap; Package: CC0603-DA; Temperature Range High: +125°C; Manufacturer Part Number: CC0603KPX7R7BB105; ComponentLink2Description: Datasheet
D3 = CMP-02539-000066-1: DIODE SCHOTTKY 40V 3A DO214AB; Peak Non-Repetitive Surge Current: 100A; Forward Voltage: 500mV; Element Configuration: Single; Max Reverse Current: 500uA; Case/Package: SMC; Radiation Hardening: No; Series: -; Max Surge Current: 100A; RoHS Compliant: Yes; Min Operating Temperature: -55°C; Average Rectified Current: 3A; Max Reverse Leakage Current: 500uA; Package Quantity: 3500; Max Reverse Voltage (DC): 40V; Forward Current: 3A; Packaging: Tape and Reel; Max Operating Temperature: 125°C; Max Repetitive Reverse Voltage (Vrrm): 40V; Number of Pins: 2; Mount: Surface Mount
L? = SRR1260-101M: Inductor; Manufacturer_Name: Bourns; Datasheet Link: https://componentsearchengine.com/Datasheets/1/SRR1260-101M.pdf; Height: 6.5mm; Manufacturer_Part_Number: SRR1260-101M; Mouser Part Number: 652-SRR1260-101M; Mouser Price/Stock: https://www.mouser.co.uk/ProductDetail/Bourns/SRR1260-101M?qs=uD%2FoUDWqfvQozr%2Ff4%252BPuSQ%3D%3D; Arrow Part Number: SRR1260-101M; Arrow Price/Stock: https://www.arrow.com/en/products/srr1260-101m/bourns?utm_currency=USD&region=nac
U2 = CMP-0069-00269-3: SIMPLE SWITCHER® Power Converter 150 KHz 3A Step-Down Voltage Regulator, 5-pin TO-263, Pb-Free; Manufacturer: Texas Instruments; PowerWise: N; PackageTopMarking: NSUZXYTTE#*LM2596S*-5.0 P+; ComponentLink1URL: http://www.ti.com/general/docs/lit/getliterature.tsp?genericPartNumber=LM2596&fileType=pdf; PackageDescription: TO-263, Molded, .400 x .390 x .180in, 5 Lead, .067in Pitch, Surface Mount; RoHS: Y; PinCount: 5; Code_JEDEC: MO-169-AB; ComponentLink1Description: Datasheet URL; PackageReference: KTT0005B; CompType: Switcher
U3 = CMP-2000-07604-2: IC REG LINEAR 3.3V 300MA SOT23-5; Quiescent Current: 38uA; Operating Supply Current: 42uA; Max Input Voltage: 5.5V; Min Input Voltage: 2.5V; Output Type: Fixed; Power Supply Rejection Ratio (PSRR): 60dB; Dropout Voltage: 380mV; Accuracy: 3%; Number of Outputs: 1; Nominal Output Voltage: 3.3V; Max Output Current: 300mA; Length: 2.9mm; Mount: Surface Mount; Width: 1.6mm; Packaging: Tape and Reel; Output Current: 300mA; Min Operating Temperature: -40°C; Max Operating Temperature: 125°C; Height: 1.1mm; Case/Package: SOT-23-5; REACH SVHC: No SVHC; Number of Pins: 5; Output Voltage: 3.3V
U4 = CMP-0367-00131-2: 30 ppm / degC Drift, 3.9 uA Voltage Reference, -40 to 125 degC, 3-pin SOT-23 (DBZ), Green (RoHS & no Sb/Br); Manufacturer: Texas Instruments; Temp Coeff(Max)(ppm/ degree C): 30; Initial Accuracy @ 25/deg C(%): 0.15; Rating: Catalog; VI(Max)(V): 5.5; Iout/Iz(Max)(mA): 5; VO(V): 2.5; VI(Min)(V): 2.66; SubFamily: Series Voltage Reference; Temp Coeff(Typ)(ppm/ degree C): 8; ComponentLink1Description: Manufacturer URL; PackageReference: DBZ0003A; ComponentLink3Description: Package Specification; PartNumber: REF3325AIDBZR; PackageVersion: 4203227/B; DatasheetVersion: SBOS392A; PackageDescription: 3-Pin Plastic Small Outline, Body 2.92 x 1.3 mm, Pitch 0.95 mm; Eco-Plan: Green (RoHS & no Sb/Br); ComponentLink2Description: Datasheet; ComponentLink3URL: http://www.ti.com/litv/pdf/mpds108a; ComponentLink2URL: http://www.ti.com/general/docs/lit/getliterature.tsp?genericPartNumber=REF3325&fileType=pdf; Iq(Max)(uA): 5; Mounting Technology: Surface Mount; ComponentLink1URL: http://www.ti.com/; Code_JEDEC: TO-236

## Nets that join several sheets
+2V5: Conditioner_Array/Designator (C2V5_Designator6.1 J1_Designator6.2), Conditioner_Array/Designator (C2V5_Designator5.1 J1_Designator5.2), Conditioner_Array/Designator (C2V5_Designator4.1 J1_Designator4.2), Conditioner_Array/Designator (C2V5_Designator3.1 J1_Designator3.2), Conditioner_Array/Designator (C2V5_Designator2.1 J1_Designator2.2), Conditioner_Array/Designator (C2V5_Designator1.1 J1_Designator1.2), Supply (+2V5.1 C20.1 U4.2)
+5: Conditioner_Array/Designator (C5V_Designator6.1 J1_Designator6.1), Conditioner_Array/Designator (C5V_Designator5.1 J1_Designator5.1), Conditioner_Array/Designator (C5V_Designator4.1 J1_Designator4.1), Conditioner_Array/Designator (C5V_Designator3.1 J1_Designator3.1), Conditioner_Array/Designator (C5V_Designator2.1 J1_Designator2.1), Conditioner_Array/Designator (C5V_Designator1.1 J1_Designator1.1), Can_Interface (C12.1 IC5.3), Supply (10 pins)
D+3.3V: MCU (13 pins), STlink (J3.4), Supply (+3.3V.1 C18.1 U3.5)
GND: MCU (17 pins), Conditioner_Array/1 (C11_1.2 D1_1.1), Conditioner_Array/2 (C11_2.2 D1_2.1), Conditioner_Array/3 (C11_3.2 D1_3.1), Conditioner_Array/4 (C11_4.2 D1_4.1), Conditioner_Array/0 (C11_0.2 D1_0.1), Conditioner_Array/5 (C11_5.2 D1_5.1), Conditioner_Array/Designator (5 pins), Conditioner_Array/Designator (5 pins), Conditioner_Array/Designator (5 pins), Conditioner_Array/Designator (5 pins), Conditioner_Array/Designator (5 pins), Conditioner_Array/Designator (5 pins), STlink (J3.2), Can_Interface (C12.2 IC5.2 IC5.8), Supply (15 pins)
CAN1_RX: MCU (U1.61), Can_Interface (IC5.4)
CAN1_TX: MCU (U1.62), Can_Interface (IC5.1)
CH0_IN_FLT: MCU (U1.27), Conditioner_Array/0 (C11_0.1 R8_0.2)
CH1_IN_FLT: MCU (U1.26), Conditioner_Array/1 (C11_1.1 R8_1.2)
CH2_IN_FLT: MCU (U1.23), Conditioner_Array/2 (C11_2.1 R8_2.2)
CH3_IN_FLT: MCU (U1.22), Conditioner_Array/3 (C11_3.1 R8_3.2)
CH4_IN_FLT: MCU (U1.21), Conditioner_Array/4 (C11_4.1 R8_4.2)
CH5_IN_FLT: MCU (U1.20), Conditioner_Array/5 (C11_5.1 R8_5.2)
in_UNFLT: Conditioner_Array/1 (D1_1.2 R8_1.1), Conditioner_Array/Designator (J1_Designator5.3)
in_UNFLT: Conditioner_Array/2 (D1_2.2 R8_2.1), Conditioner_Array/Designator (J1_Designator4.3)
in_UNFLT: Conditioner_Array/3 (D1_3.2 R8_3.1), Conditioner_Array/Designator (J1_Designator3.3)
in_UNFLT: Conditioner_Array/4 (D1_4.2 R8_4.1), Conditioner_Array/Designator (J1_Designator2.3)
in_UNFLT: Conditioner_Array/0 (D1_0.2 R8_0.1), Conditioner_Array/Designator (J1_Designator6.3)
in_UNFLT: Conditioner_Array/5 (D1_5.2 R8_5.1), Conditioner_Array/Designator (J1_Designator1.3)
NRST: MCU (R1.2 R2.1 U1.7), STlink (J3.5)
SWCLK: MCU (U1.49), STlink (J3.3)
SWDIO: MCU (U1.46), STlink (J3.1)